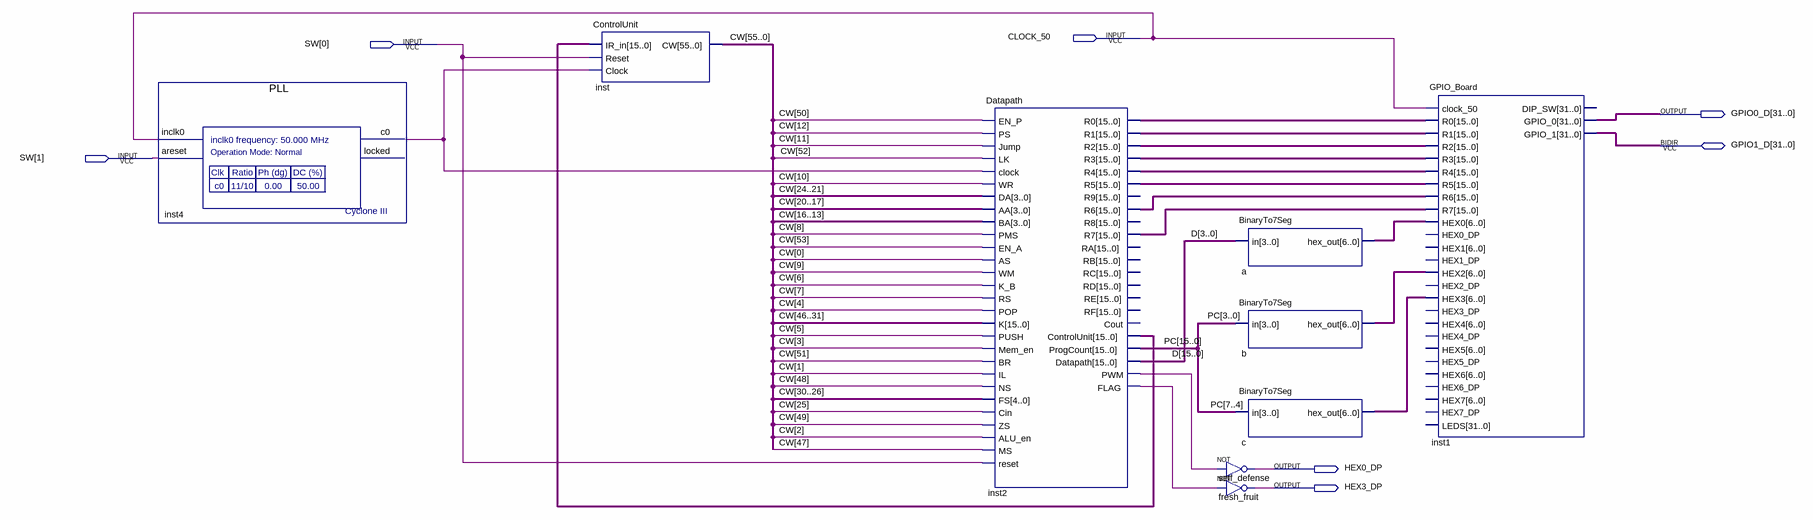
[diagram p0: schematic sheet]
// Quartus schematic CU_Datapath_GPIO.bdf as structural Verilog: 9 symbols, 7 pins
module CU_Datapath_GPIO (
  input  CLOCK_50,
  input  [1:0] SW,
  inout  [31:0] GPIO1_D,
  output [31:0] GPIO0_D,
  output HEX0_DP,
  output HEX3_DP
);

  wire inst2_flag, inst2_pwm, inst4_c0;
  wire [6:0] a_hex_out, b_hex_out, c_hex_out;
  wire [15:0] D, inst2_controlunit, inst2_r0, inst2_r1, inst2_r2, inst2_r3, inst2_r4, inst2_r5, inst2_r6,
       inst2_r7, PC;
  wire [55:0] CW;

  PLL inst4 (.inclk0(CLOCK_50), .areset(SW[1]), .c0(inst4_c0));  // open: locked
  ControlUnit inst (.IR_in(inst2_controlunit), .Reset(SW[0]), .Clock(inst4_c0), .CW(CW));
  Datapath inst2 (
    .EN_P(CW[50]), .PS(CW[12]), .Jump(CW[11]), .LK(CW[52]), .clock(inst4_c0), .WR(CW[10]), .DA(CW[24:21]),
    .AA(CW[20:17]), .BA(CW[16:13]), .PMS(CW[8]), .EN_A(CW[53]), .AS(CW[0]), .WM(CW[9]), .K_B(CW[6]),
    .RS(CW[7]), .POP(CW[4]), .K(CW[46:31]), .PUSH(CW[5]), .Mem_en(CW[3]), .BR(CW[51]), .IL(CW[1]),
    .NS(CW[48]), .FS(CW[30:26]), .Cin(CW[25]), .ZS(CW[49]), .ALU_en(CW[2]), .MS(CW[47]), .reset(SW[0]),
    .R0(inst2_r0), .R1(inst2_r1), .R2(inst2_r2), .R3(inst2_r3), .R4(inst2_r4), .R5(inst2_r5), .R6(inst2_r6),
    .R7(inst2_r7), .ControlUnit(inst2_controlunit), .ProgCount(PC), .Datapath(D), .PWM(inst2_pwm),
    .FLAG(inst2_flag));  // open: R9, R8, RA, RB, RC, RD, RE, RF, Cout
  not self_defense (HEX0_DP, inst2_pwm);
  not fresh_fruit (HEX3_DP, inst2_flag);
  BinaryTo7Seg a (.in(D[3:0]), .hex_out(a_hex_out));
  BinaryTo7Seg b (.in(PC[3:0]), .hex_out(b_hex_out));
  BinaryTo7Seg c (.in(PC[7:4]), .hex_out(c_hex_out));
  GPIO_Board inst1 (
    .clock_50(CLOCK_50), .R0(inst2_r0), .R1(inst2_r1), .R2(inst2_r2), .R3(inst2_r3), .R4(inst2_r4),
    .R5(inst2_r5), .R6(inst2_r6), .R7(inst2_r7), .HEX0(a_hex_out), .HEX2(b_hex_out), .HEX3(c_hex_out),
    .GPIO_0(GPIO0_D), .GPIO_1(GPIO1_D));  // open: HEX0_DP, HEX1, HEX1_DP, HEX2_DP, HEX3_DP, HEX4, HEX4_DP, HEX5, HEX5_DP, HEX6, HEX6_DP, HEX7, HEX7_DP, LEDS, DIP_SW
endmodule
